# EAGLE design mega128 (EAGLE 6.4)
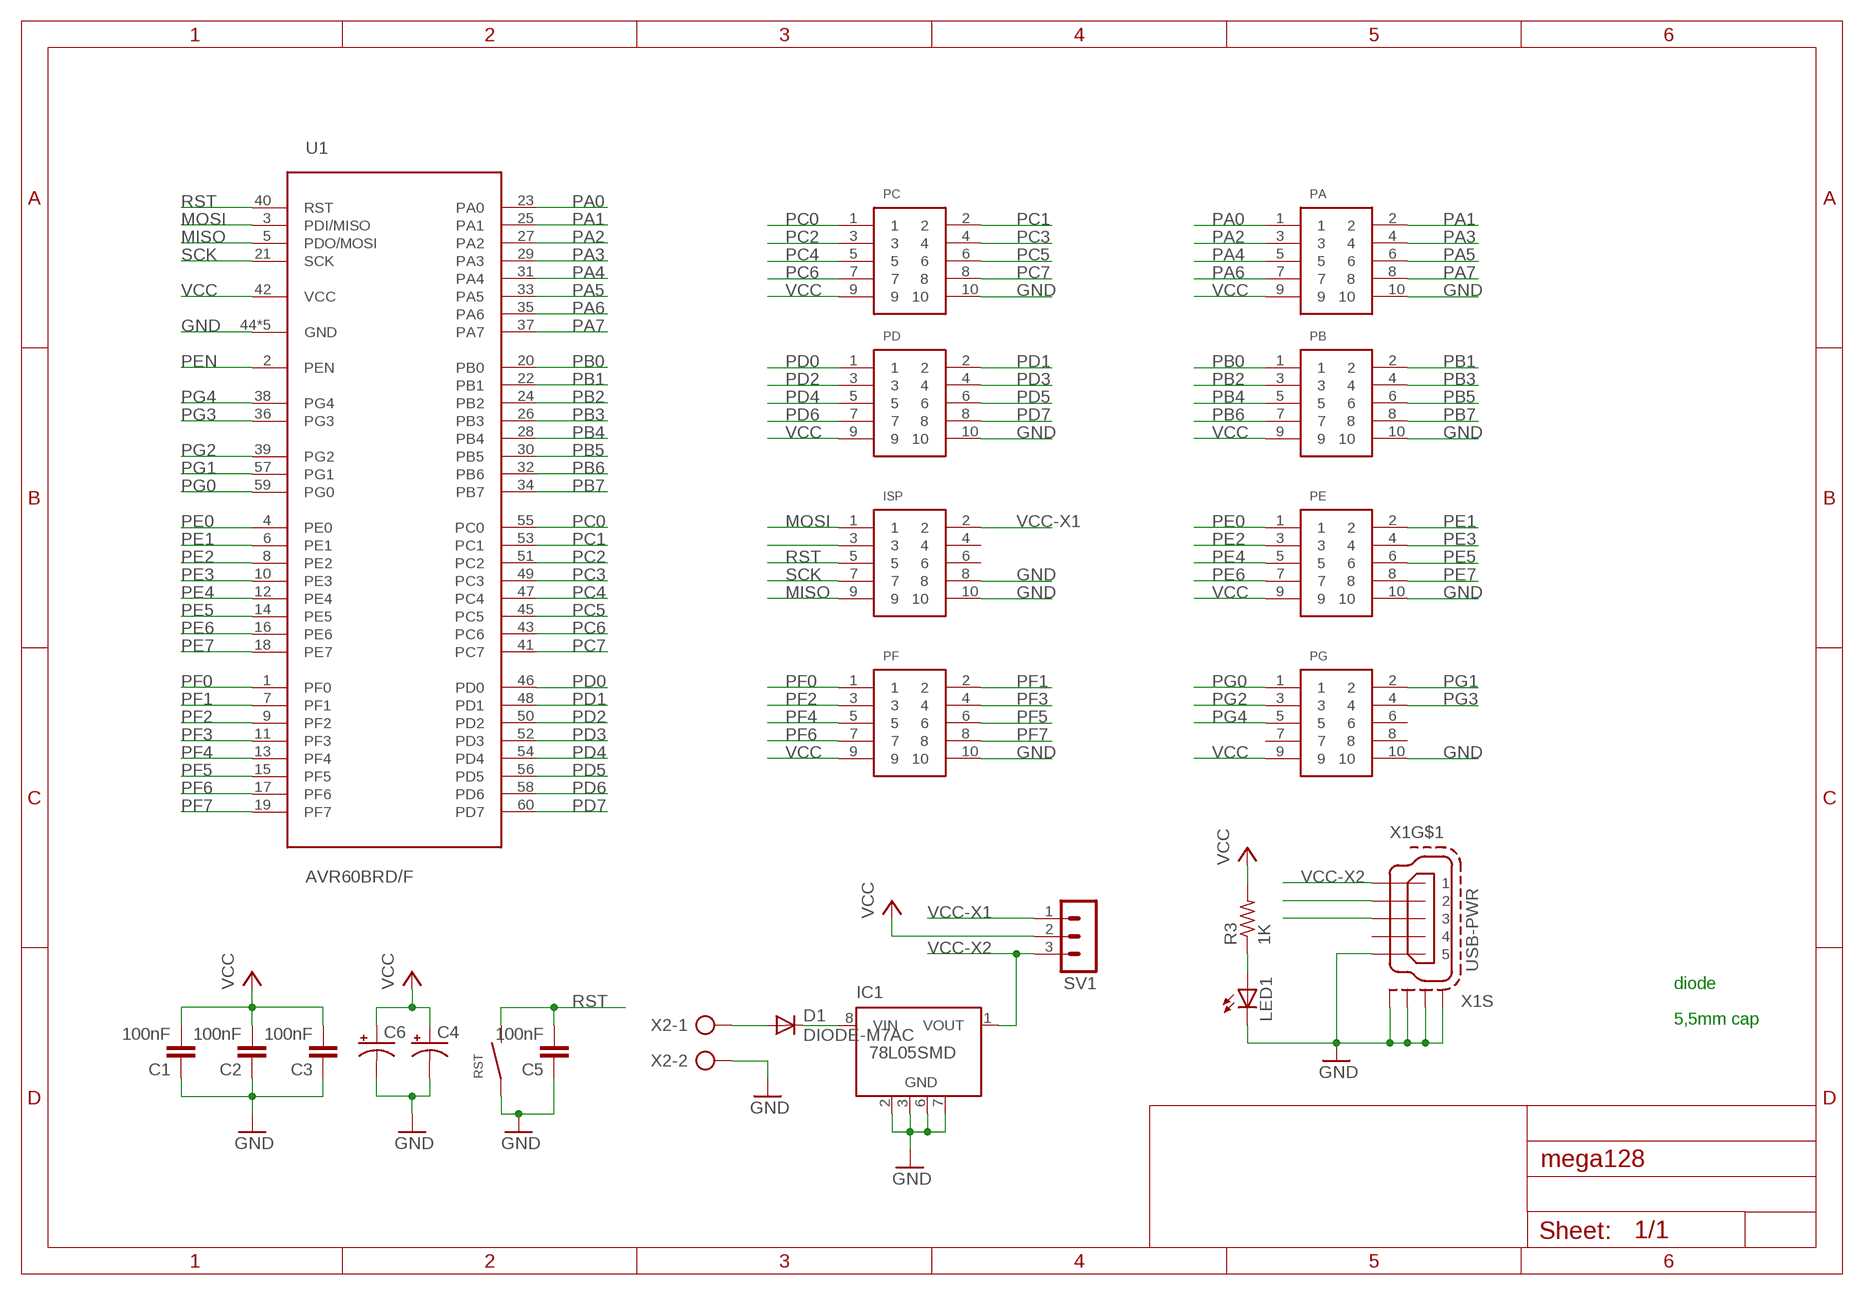
[diagram p0: schematic, sheet 1]

## Parts
C1  100nF  C-EUC0805  [C0805]
C2  100nF  C-EUC0805  [C0805]
C3  100nF  C-EUC0805  [C0805]
C4  CPOL-US085CS-1AR  [085CS_1AR]
C5  100nF  C-EUC0805  [C0805]
C6  CPOL-US085CS-1AR  [085CS_1AR]
D1  DIODE-M7AC  [M7]
IC1  78L05SMD  [SO08]
ISP  IDC-SOCK  [IDC-SOCK]
LED1  LEDSML0805  [SML0805]
PA  IDC-SOCK  [IDC-SOCK]
PB  IDC-SOCK  [IDC-SOCK]
PC  IDC-SOCK  [IDC-SOCK]
PD  IDC-SOCK  [IDC-SOCK]
PE  IDC-SOCK  [IDC-SOCK]
PF  IDC-SOCK  [IDC-SOCK]
PG  IDC-SOCK  [IDC-SOCK]
R3  1K  R-US_R0805  [R0805]
RST  SMD-BTN  [SMD-BTN]
SV1  MA03-1  [MA03-1]
U1  AVR60BRD/F  [AVR60-BRD]
X1  USB-PWR  MINI-USB-SCHIELD-32005-201  [32005-201]
X2  AK300/2  [AK300/2]

## Nets
GND: C1.1 C2.1 C3.1 C4.- C5.1 C6.- IC1.2(GND) IC1.3(GND) IC1.6(GND) IC1.7(GND) ISP.8 ISP.10 LED1.C PA.10 PB.10 PC.10 PD.10 PE.10 PF.10 PG.10 RST.1 U1.44(GND) U1.61(GND) U1.62(GND) U1.63(GND) U1.64(GND) X1.5 X1.M1(S:S1) X1.M2(S:S2) X1.M3(S:S3) X1.M4(S:S4) X2.2
MISO: ISP.9 U1.5(PDO/MOSI)
MOSI: ISP.1 U1.3(PDI/MISO)
N$1: X1.2
N$2: X1.3
N$3: LED1.A R3.1
N$7: D1.2(A) X2.1
N$9: D1.1(C) IC1.8(VIN)
N$10: ISP.3
PA0: PA.1 U1.23(PA0)
PA1: PA.2 U1.25(PA1)
PA2: PA.3 U1.27(PA2)
PA3: PA.4 U1.29(PA3)
PA4: PA.5 U1.31(PA4)
PA5: PA.6 U1.33(PA5)
PA6: PA.7 U1.35(PA6)
PA7: PA.8 U1.37(PA7)
PB0: PB.1 U1.20(PB0)
PB1: PB.2 U1.22(PB1)
PB2: PB.3 U1.24(PB2)
PB3: PB.4 U1.26(PB3)
PB4: PB.5 U1.28(PB4)
PB5: PB.6 U1.30(PB5)
PB6: PB.7 U1.32(PB6)
PB7: PB.8 U1.34(PB7)
PC0: PC.1 U1.55(PC0)
PC1: PC.2 U1.53(PC1)
PC2: PC.3 U1.51(PC2)
PC3: PC.4 U1.49(PC3)
PC4: PC.5 U1.47(PC4)
PC5: PC.6 U1.45(PC5)
PC6: PC.7 U1.43(PC6)
PC7: PC.8 U1.41(PC7)
PD0: PD.1 U1.46(PD0)
PD1: PD.2 U1.48(PD1)
PD2: PD.3 U1.50(PD2)
PD3: PD.4 U1.52(PD3)
PD4: PD.5 U1.54(PD4)
PD5: PD.6 U1.56(PD5)
PD6: PD.7 U1.58(PD6)
PD7: PD.8 U1.60(PD7)
PE0: PE.1 U1.4(PE0)
PE1: PE.2 U1.6(PE1)
PE2: PE.3 U1.8(PE2)
PE3: PE.4 U1.10(PE3)
PE4: PE.5 U1.12(PE4)
PE5: PE.6 U1.14(PE5)
PE6: PE.7 U1.16(PE6)
PE7: PE.8 U1.18(PE7)
PEN: U1.2(PEN)
PF0: PF.1 U1.1(PF0)
PF1: PF.2 U1.7(PF1)
PF2: PF.3 U1.9(PF2)
PF3: PF.4 U1.11(PF3)
PF4: PF.5 U1.13(PF4)
PF5: PF.6 U1.15(PF5)
PF6: PF.7 U1.17(PF6)
PF7: PF.8 U1.19(PF7)
PG0: PG.1 U1.59(PG0)
PG1: PG.2 U1.57(PG1)
PG2: PG.3 U1.39(PG2)
PG3: PG.4 U1.36(PG3)
PG4: PG.5 U1.38(PG4)
RST: C5.2 ISP.5 RST.2 U1.40(RST)
SCK: ISP.7 U1.21(SCK)
VCC: C1.2 C2.2 C3.2 C4.+ C6.+ PA.9 PB.9 PC.9 PD.9 PE.9 PF.9 PG.9 R3.2 SV1.2 U1.42(VCC)
VCC-X1: ISP.2 SV1.1
VCC-X2: IC1.1(VOUT) SV1.3 X1.1
Unconnected: IC1.4(NC) IC1.5(NC) ISP.4 ISP.6 PG.6 PG.7 PG.8 X1.4

## Notes on the sheet
- diode
- 5,5mm cap

## Library data of the parts
C1-C3 C5 = resistor:C-EU: CAPACITOR, European symbol
C4 C6 = rcl:CPOL-US: POLARIZED CAPACITOR, American symbol
D1 = IyunLib:DIODE-M7: DO-214AC
IC1 = linear:78L*SMD: Positive VOLTAGE REGULATOR
ISP PA PB PC PD PE PF PG = IyunLib:IDC-SOCK
LED1 = led:LED: LED OSRAM: - CHIPLED LG R971, LG N971, LY N971, LG Q971, LY Q971, LO R971, LY R971 LH N974, LH R974 LS Q976, LO Q976, LY Q976 LO Q996 - Hyper CHIPLED LW Q18S LB Q993, LB Q99A, LB R99A - SideLED LS A670, LO A670, LY A670, LG A670, LP A670 LB A673, LV A673, LT A673, LW A673 LH A674 LY A675 LS A676, LA A676, LO A676, LY A676, LW A676 LS A679, LY A679, LG A679 - Hyper Micro SIDELED® LS Y876, LA Y876, LO Y876, LY Y876 LT Y87S - SmartLED LW L88C, LW L88S LB L89C, LB L89S, LG L890 LS L89K, LO L89K, LY L89K LS L896, LA L896, LO L896, LY L896 - TOPLED LS T670, LO T670, LY T670, LG T670, LP T670 LSG T670, LSP T670, LSY T670, LOP T670, LYG T670 LG T671, LOG T671, LSG T671 LB T673, LV T673, LT T673, LW T673 LH T674 LS T676, LA T676, LO T676, LY T676, LB T676, LH T676, LSB T676, LW T676 LB T67C, LV T67C, LT T67C, LS T67K, LO T67K, LY T67K, LW E67C LS E67B, LA E67B, LO E67B, LY E67B, LB E67C, LV E67C, LT E67C LW T67C LS T679, LY T679, LG T679 LS T770, LO T770, LY T770, LG T770, LP T770 LB T773, LV T773, LT T773, LW T773 LH T774 LS E675, LA E675, LY E675, LS T675 LS T776, LA T776, LO T776, LY T776, LB T776 LHGB T686 LT T68C, LB T68C - Hyper Mini TOPLED® LB M676 - Mini TOPLED Santana® LG M470 LS M47K, LO M47K, LY M47K Source: http://www.osram.convergy.de LUXEON: - LUMILED® LXK2-PW12-R00, LXK2-PW12-S00, LXK2-PW14-U00, LXK2-PW14-V00 LXK2-PM12-R00, LXK2-PM12-S00, LXK2-PM14-U00 LXK2-PE12-Q00, LXK2-PE12-R00, LXK2-PE12-S00, LXK2-PE14-T00, LXK2-PE14-U00 LXK2-PB12-K00, LXK2-PB12-L00, LXK2-PB12-M00, LXK2-PB14-N00, LXK2-PB14-P00, LXK2-PB14-Q00 LXK2-PR12-L00, LXK2-PR12-M00, LXK2-PR14-Q00, LXK2-PR14-R00 LXK2-PD12-Q00, LXK2-PD12-R00, LXK2-PD12-S00 LXK2-PH12-R00, LXK2-PH12-S00 LXK2-PL12-P00, LXK2-PL12-Q00, LXK2-PL12-R00 Source: www.luxeon.com KINGBRIGHT: KA-3528ASYC Source: www.kingbright.com
R3 = resistor:R-US_: RESISTOR, American symbol
RST = IyunLib:SMD-BTN
SV1 = con-lstb:MA03-1: PIN HEADER; OC_FARNELL: unknown; OC_NEWARK: unknown
U1 = IyunLib:AVR60
X1 = con-cypressindustries:MINI-USB-SCHIELD-: MINI USB-B Conector Source: www.cypressindustries.com; OC_FARNELL: unknown; OC_NEWARK: unknown
X2 = con-ptr500:AK300/2: CONNECTOR; OC_FARNELL: unknown; OC_NEWARK: unknown

## Board
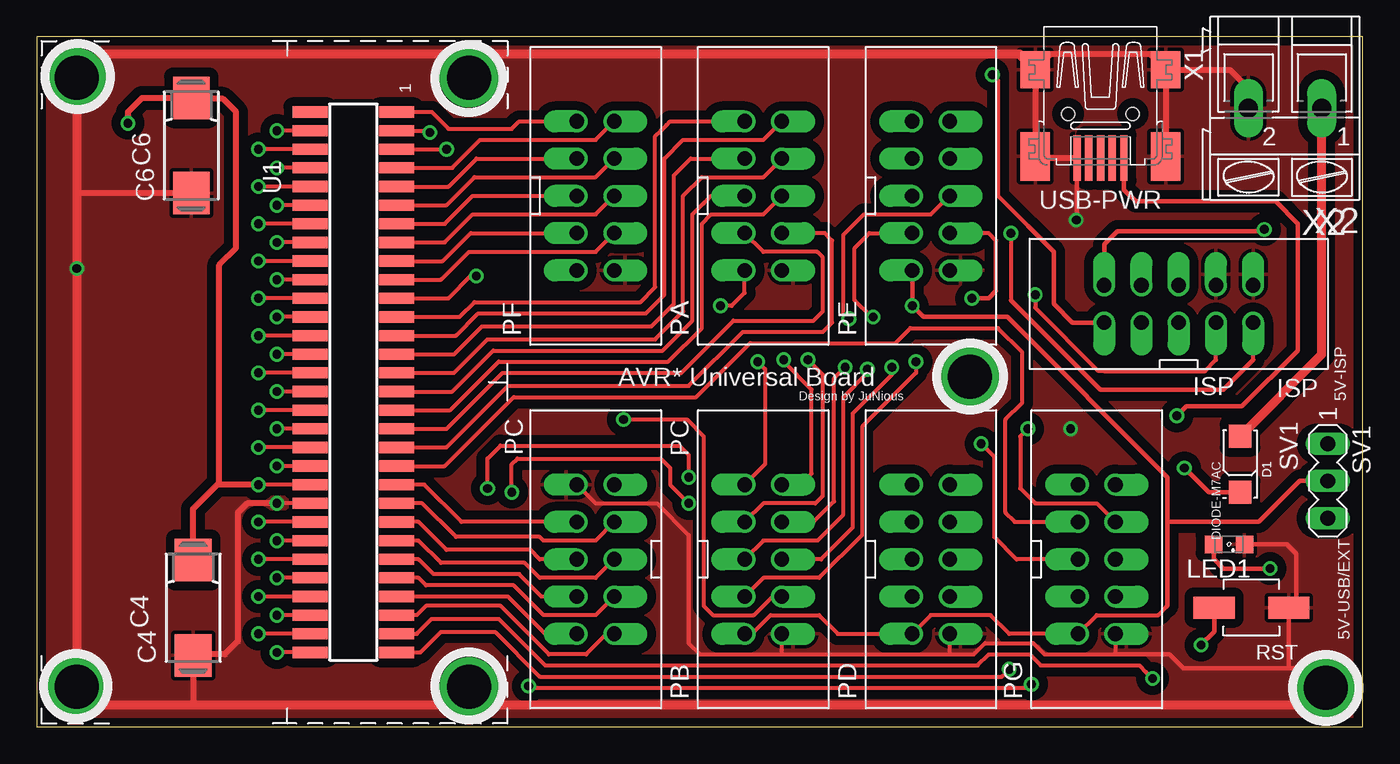
[diagram p1: board, top side]
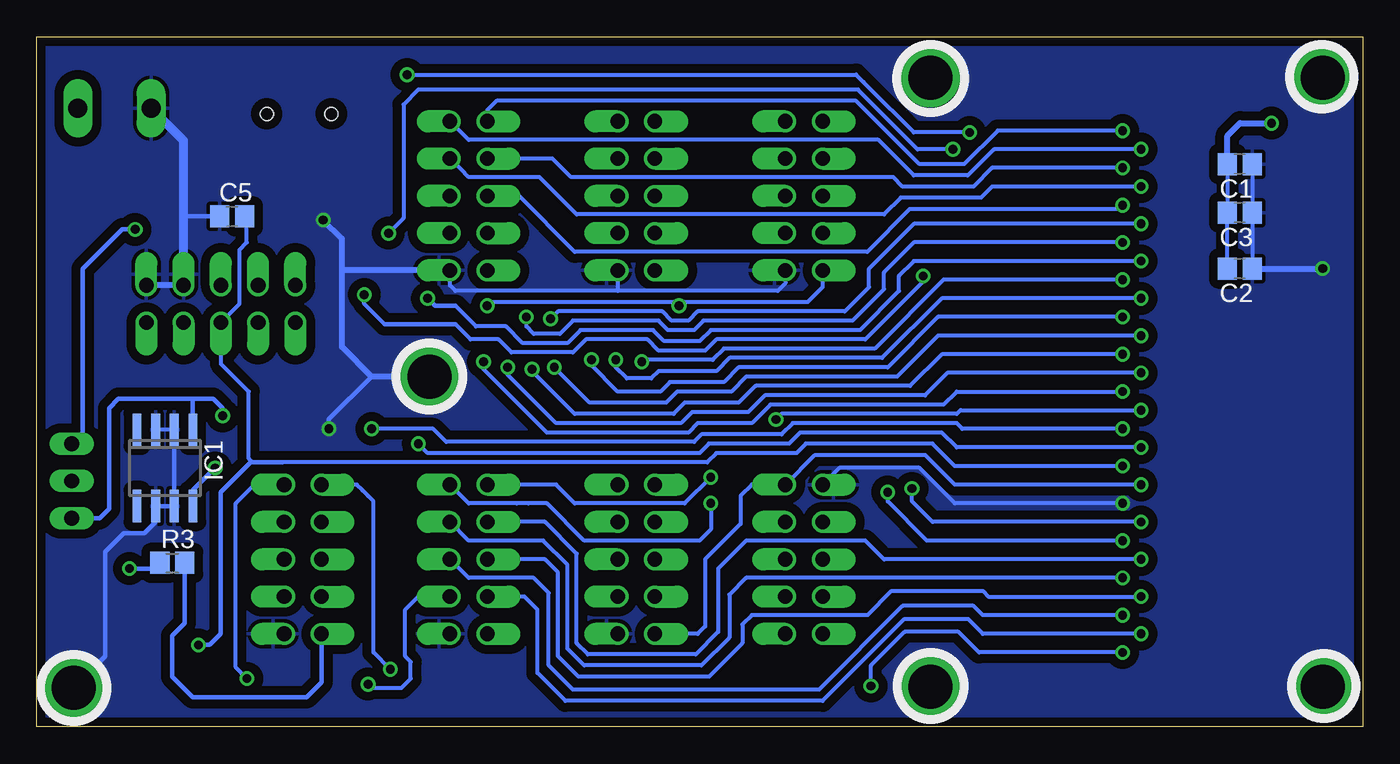
[diagram p2: board, bottom side, seen from below]

Size 90.4 x 47.04 mm. Coordinates in mm from the lower left corner, seen from the top.
Outline: 0,0 90.4,0 90.4,47.04 0,47.04 0,0
Copper layers (1*16): Top 0.035mm / dielectric 1.5mm / Bottom 0.035mm
Design rules "default *": minimum track width 10mil, minimum drill 20mil, track to track 10mil, track to pad 10mil, pad to pad 10mil, via to via 10mil, smd to smd 6mil, copper to edge 20mil, drill to drill 8mil, minimum pad ring 10mil, minimum via ring 8mil, stop-mask expansion 4mil, vias tented up to drill 0mil, thermal gap 10mil
tRestrict: area 20.3,5 to 22.9,42.2

### Footprints (pad centres in the part's own frame; a part is rotated, then mirrored left to right if it is on the bottom)
C0805 = smd 1.3 x 1.5: 1 -0.85,0; 2 0.85,0
085CS_1AR = smd 2.9 x 2.5: + 3.25,0; - -3.25,0
M7 = smd 1.57 x 1.55: 1 1.915,0; 2 -1.915,0
SO08 = smd 0.6 x 2.2: 1 -1.905,-2.6; 2 -0.635,-2.6; 3 0.635,-2.6; 4 1.905,-2.6; 5 1.905,2.6; 6 0.635,2.6; 7 -0.635,2.6; 8 -1.905,2.6
IDC-SOCK = drill 1 offset: 1 -1.27,5.08; 2 1.27,5.08; 3 -1.27,2.54; 4 1.27,2.54; 5 -1.27,0; 6 1.27,0; 7 -1.27,-2.54; 8 1.27,-2.54; 9 -1.27,-5.08; 10 1.27,-5.08
SML0805 = smd 1.2 x 1.2: A 1.05,0; C -1.05,0
R0805 = smd 1.3 x 1.5: 1 -0.85,0; 2 0.85,0
SMD-BTN = smd 2.8 x 1.5: 1 -2.54,0; 2 2.54,0
MA03-1 = drill 1.016 long: 1 -2.54,0; 2 0,0; 3 2.54,0
AVR60-BRD = smd 0.76 x 2.4: 1 18.415,-2.95; 2 18.415,2.95; 3 17.145,-2.95; 4 17.145,2.95; 5 15.875,-2.95; 6 15.875,2.95; 7 14.605,-2.95; 8 14.605,2.95; 9 13.335,-2.95; 10 13.335,2.95; 11 12.065,-2.95; 12 12.065,2.95; 13 10.795,-2.95; 14 10.795,2.95; 15 9.525,-2.95; 16 9.525,2.95; 17 8.255,-2.95; 18 8.255,2.95; 19 6.985,-2.95; 20 6.985,2.95; 21 5.715,-2.95; 22 5.715,2.95; 23 4.445,-2.95; 24 4.445,2.95; 25 3.175,-2.95; 26 3.175,2.95; 27 1.905,-2.95; 28 1.905,2.95; 29 0.635,-2.95; 30 0.635,2.95; 31 -0.635,-2.95; 32 -0.635,2.95; 33 -1.905,-2.95; 34 -1.905,2.95; 35 -3.175,-2.95; 36 -3.175,2.95; 37 -4.445,-2.95; 38 -4.445,2.95; 39 -5.715,-2.95; 40 -5.715,2.95; 41 -6.985,-2.95; 42 -6.985,2.95; 43 -8.255,-2.95; 44 -8.255,2.95; 45 -9.525,-2.95; 46 -9.525,2.95; 47 -10.795,-2.95; 48 -10.795,2.95; 49 -12.065,-2.95; 50 -12.065,2.95; 51 -13.335,-2.95; 52 -13.335,2.95; 53 -14.605,-2.95; 54 -14.605,2.95; 55 -15.875,-2.95; 56 -15.875,2.95; 57 -17.145,-2.95; 58 -17.145,2.95; 59 -18.415,-2.95; 60 -18.415,2.95 | drill 3: 61 20.75,-7.9; 62 -20.75,-7.9; 63 -20.75,18.85; 64 20.75,18.85
32005-201 = smd 3.1 x 0.5: 1 3,1.6; 2 3,0.8; 3 3,0; 4 3,-0.8; 5 3,-1.6 | smd 2.5 x 2: M1 -3,-4.45; M2 -3,4.45 | smd 3.3 x 2: M3 2.9,4.45; M4 2.9,-4.45 | hole 0.9: 0,2.2; 0,-2.2
AK300/2 = drill 1.321 long: 1 -2.515,0; 2 2.489,0

### Placement (x,y rotation side)
C1  8.38,38.35 180 bottom
C2  8.38,31.24 180 bottom
C3  8.38,35.05 180 bottom
C4  10.67,8.13 90 top
C5  77.09,34.8 0 bottom
C6  10.54,39.62 90 top
D1  82.04,17.91 270 top
IC1  81.66,17.65 180 bottom
ISP  77.85,28.83 90 top
LED1  81.28,12.45 180 top
PA  49.53,36.2 0 top
PB  49.53,11.43 0 top
PC  38.1,11.43 180 top
PD  60.96,11.43 0 top
PE  60.96,36.2 0 top
PF  38.1,36.2 0 top
PG  72.26,11.43 0 top
R3  81.15,11.18 0 bottom
RST  82.8,8.13 180 top
SV1  88.01,16.76 270 top
U1  21.59,23.5 90 top
X1  72.52,41.78 270 top
X2  85.09,42.16 180 top

### Tracks (layer width: path | path; a pad name or v marks a point on that pad's centre or on a via)
GND  (via drill 0.6, 3)
  Top 0.28: U1.44 v16.38,15.24 | PC.10 38.1,15.24 42.29,15.24 44.45,13.08 44.45,5.71 45.21,4.95 50.8,4.95 | 50.8,4.95 PB.10 | 50.8,4.95 62.23,4.95 | PG.10 73.53,5.08 73.66,4.95 | PD.10 62.23,4.95 | 70.87,38.73 X1.5 | 62.23,4.95 63.88,4.95 64.64,5.71 67.94,5.71 68.71,4.95 74.55,4.95
  Top 0.305: v87.88,2.67 86.55,4 85.34,4 | 85.34,4 RST.1 85.85,8.64 85.85,11.81 85.22,12.45 LED1.C | 73.66,4.95 74.55,4.95 77.22,4.95 78.17,4 85.34,4 | 67.64,45.21 X1.M1 | X1.5 70.92,34.59 v70.87,34.54 | 29.49,45.82 29.46,45.85
  Top 0.406: X1.5 68.17,38.78 X1.M4 X1.M1 68.07,44.83 69.09,45.85 75.9,45.85 X1.M2 | X1.M2 81.33,44.78 82.6,43.51 X2.2 | X1.M2 X1.M3 76.97,37.59 | C4.- 10.67,1.65 10.79,1.52 | v16.38,15.24 14.35,15.24 13.72,14.61 13.72,5.84 12.83,4.95 10.54,4.95 | C6.- 2.92,36.37 2.74,36.2
  Top 0.61: 67.64,45.21 67,45.85 29.46,45.85 4.34,45.85 U1.64 2.74,36.2 v2.74,31.24 U1.63 3.96,1.52 10.79,1.52 29.46,1.52 | 29.46,1.52 86.74,1.52 v87.88,2.67 | U1.62 29.49,1.55 29.46,1.52 | U1.61 29.49,45.82
  Bottom 0.28: PF.10 39.37,30.23 39.88,29.72 50.8,29.72 | 50.8,29.72 61.85,29.72 62.23,30.1 PE.10 | PA.10 50.8,29.72 | v16.38,15.24 27.81,15.24 30.23,17.65 35.69,17.65 PC.10 | C1.1 C3.1 C2.1 | 79.76,34.8 C5.1 77.72,34.8 | 70.74,34.54 v70.87,34.54 | IC1.2 IC1.3
  Bottom 0.305: 77.72,34.8 80.26,34.8 80.39,34.67 | v87.88,2.67 85.72,4.83 85.72,11.94 84.45,13.21 83.06,13.21 82.3,13.97 IC1.6 IC1.7 IC1.2 | v70.48,20.32 70.48,20.95 67.56,23.88
  Bottom 0.406: ISP.8 ISP.10 | v63.63,23.88 67.56,23.88 69.6,25.91 69.6,31.11 | 69.6,31.11 69.6,33.27 v70.87,34.54 | PE.10 69.6,31.11 | C2.1 v2.74,31.24
  Bottom 0.61: ISP.8 80.39,34.67 80.39,39.95 X2.2
  pour Bottom (isolate 0.61): 0.38,46.74 90.17,46.74 90.17,0.25 0.38,0.25
  pour Top (isolate 0.61): 0.38,46.74 90.17,46.74 90.17,0.25 0.38,0.25
MISO  (via drill 0.6)
  Top 0.28: 82.93,25.02 ISP.9 | v66.42,33.66 66.42,29.08 | U1.5 v27.94,39.37
  Top 0.305: 66.42,29.08 72.52,22.99 80.9,22.99 82.93,25.02
  Bottom 0.28: v27.94,39.37 30.35,39.37 34.42,43.43 64.39,43.43 65.41,42.42 65.41,34.67 v66.42,33.66
MOSI  (via drill 0.6)
  Top 0.28: 67.56,34.16 65.53,36.2 65.53,44.07 v65.15,44.45 | U1.3 26.67,40.64 v26.8,40.51
  Top 0.305: 67.56,34.16 69.34,32.38 69.34,28.83 70.61,27.56 ISP.1
  Bottom 0.28: v26.8,40.51 30.61,40.51 33.66,43.56 34.04,43.94 34.54,44.45 v65.15,44.45
N$3  (via drill 0.6)
  Top 0.305: LED1.A 80.23,11.46 80.9,10.79 v84.07,10.79
  Bottom 0.305: R3.1 82.38,10.79 v84.07,10.79
N$7
  Top 0.61: D1.2 87.61,25.39 X2.1
N$9  (via drill 0.6)
  Top 0.305: D1.1 79.89,15.99 v78.23,17.65
  Bottom 0.305: v78.23,17.65 79.76,16.13 IC1.8
PA0
  Top 0.28: U1.23 28.83,27.94 29.84,28.96 41.15,28.96 42.16,29.97 42.16,40.26 42.55,40.64 42.93,41.02 43.18,41.27 PA.1
PA1
  Top 0.28: U1.25 28.57,26.67 30.1,28.19 41.53,28.19 42.8,29.46 42.8,38.73 44.07,40.01 49.53,40.01 PA.2
PA2
  Top 0.28: U1.27 28.45,25.4 30.35,27.3 41.91,27.3 43.43,28.83 43.43,37.59 43.94,38.1 44.13,38.29 44.58,38.73 PA.3
PA3
  Top 0.28: U1.29 28.45,24.13 30.73,26.42 42.16,26.42 44.07,28.32 44.07,36.2 45.34,37.47 49.53,37.47 PA.4
PA4
  Top 0.28: U1.31 28.32,22.86 31.11,25.65 42.67,25.65 44.7,27.69 44.7,34.92 45.47,35.69 45.72,35.94 45.97,36.2 PA.5
PA5
  Top 0.28: U1.33 28.19,21.59 31.5,24.89 43.05,24.89 45.34,27.18 45.34,34.29 45.97,34.92 49.53,34.92 PA.6
PA6
  Top 0.28: U1.35 27.94,20.32 31.75,24.13 43.94,24.13 47.5,27.69 52.96,27.69 53.59,28.32 53.59,32 53.21,32.38 49.53,32.38 PA.7
PA7
  Top 0.28: U1.37 27.94,19.05 32.13,23.24 44.45,23.24 48.13,26.92 53.59,26.92 54.23,27.56 54.23,33.15 53.72,33.66 PA.8
PB0  (via drill 0.6)
  Top 0.28: U1.20 v16.38,30.48 | PB.1 49.66,17.91 49.66,24.38 v49.15,24.89
  Bottom 0.28: v16.38,30.48 28.57,30.48 33.27,25.78 43.56,25.78 44.32,25.02 49.02,25.02 v49.15,24.89
PB1  (via drill 0.6)
  Top 0.28: U1.22 v15.11,29.21 | PB.2 52.07,16.51 52.83,17.27 52.83,22.99 50.93,24.89 v50.93,25.02
  Bottom 0.28: v15.11,29.21 28.7,29.21 32.77,25.15 43.18,25.15 44.07,24.26 48.01,24.26 48.51,23.75 50.16,23.75 50.93,24.51 v50.93,25.02
PB2  (via drill 0.6)
  Top 0.28: U1.24 v16.38,27.94 | PB.3 49.53,15.24 53.09,15.24 53.59,15.75 53.59,24 v52.58,25.02
  Bottom 0.28: v16.38,27.94 28.96,27.94 32.38,24.51 42.55,24.51 43.56,23.5 47.24,23.5 47.88,22.86 50.8,22.86 52.58,24.64 v52.58,25.02
PB3  (via drill 0.6)
  Top 0.28: U1.26 v15.11,26.67 | PB.4 52.96,13.97 54.36,15.37 54.36,23.75 v55.12,24.51
  Bottom 0.28: v15.11,26.67 28.96,26.67 31.75,23.88 42.04,23.88 43.05,22.86 46.74,22.86 47.5,22.1 52.7,22.1 v55.12,24.51
PB4  (via drill 0.6)
  Top 0.28: U1.28 v16.38,25.4 | v56.64,24.38 56.64,24.13 54.99,22.48 54.99,14.48 53.21,12.7 49.53,12.7 PB.5
  Bottom 0.28: v16.38,25.4 28.7,25.4 30.86,23.24 41.4,23.24 42.55,22.1 46.23,22.1 46.99,21.34 53.72,21.34 55.75,23.37 55.82,23.43 56.64,24.26 v56.64,24.38
PB5  (via drill 0.6)
  Top 0.28: U1.30 v15.11,24.13 | v58.29,24.51 58.29,24 55.63,21.34 55.63,13.59 53.47,11.43 PB.6
  Bottom 0.28: v15.11,24.13 28.32,24.13 29.84,22.61 40.77,22.61 41.91,21.46 45.72,21.46 46.48,20.7 54.99,20.7 56.9,22.61 57.4,23.11 58.29,24 v58.29,24.51
PB6  (via drill 0.6)
  Top 0.28: U1.32 v16.38,22.86 | v59.94,24.89 59.94,24.13 56.26,20.45 56.26,13.08 53.34,10.16 49.53,10.16 PB.7
  Bottom 0.28: v59.94,24.89 59.94,24.38 57.53,21.97 57.4,21.84 55.63,20.07 45.97,20.07 45.34,20.7 41.66,20.7 40.39,21.97 28.57,21.97 27.69,22.86 v16.38,22.86
PB7  (via drill 0.6)
  Top 0.28: U1.34 v15.11,21.59 | v40.01,20.95 44.32,20.95 45.47,19.81 45.47,8.26 46.1,7.62 48.9,7.62 50.16,8.89 PB.8
  Bottom 0.28: v40.01,20.95 39.62,21.34 27.69,21.34 27.43,21.59 v15.11,21.59
PC0
  Top 0.28: PC.1 38.86,6.35 37.47,4.95 34.92,4.95 31.62,8.26 26.54,8.26 25.91,7.62 U1.55
PC1
  Top 0.28: PC.2 34.67,6.35 32.13,8.89 U1.53
PC2
  Top 0.28: PC.3 38.1,7.62 34.54,7.62 32.51,9.65 26.54,9.65 26.04,10.16 U1.51
PC3
  Top 0.28: PC.4 34.42,8.89 32.89,10.41 27.05,10.41 26.04,11.43 U1.49
PC4
  Top 0.28: PC.5 38.1,10.16 34.29,10.16 33.27,11.18 27.56,11.18 26.04,12.7 U1.47
PC5
  Top 0.28: PC.6 34.29,11.43 33.66,12.06 27.94,12.06 26.04,13.97 U1.45
PC6
  Top 0.28: PC.7 38.1,12.7 34.54,12.7 34.29,12.95 28.57,12.95 26.29,15.24 U1.43
PC7
  Top 0.28: PC.8 28.96,13.97 26.42,16.51 U1.41
PD0  (via drill 0.6)
  Top 0.28: U1.46 v15.11,13.97 | v30.73,16.26 30.73,18.29 31.62,19.18 43.81,19.18 44.45,18.54 v44.45,17.02
  Bottom 0.28: v15.11,13.97 29.34,13.97 30.73,15.37 v30.73,16.26 | v44.45,17.02 46.23,15.24 53.72,15.24 54.99,16.51 PD.1
PD1  (via drill 0.6)
  Top 0.28: U1.48 v16.38,12.7 | v32.38,16 32.38,17.91 32.77,18.29 42.55,18.29 43.18,17.65 43.18,16.51 v44.45,15.24
  Bottom 0.28: v16.38,12.7 29.72,12.7 32.38,15.37 v32.38,16 | PD.2 60.96,15.24 57.66,15.24 56.9,15.24 55.63,15.24 53.09,12.7 45.21,12.7 44.45,13.46 v44.45,15.24
PD2  (via drill 0.6)
  Top 0.28: U1.50 v15.11,11.43
  Bottom 0.28: v15.11,11.43 32.64,11.43 33.91,12.7 42.04,12.7 43.94,10.79 43.94,6.48 45.47,4.95 52.83,4.95 53.59,5.71 53.59,11.81 55.75,13.97 PD.3
PD3  (via drill 0.6)
  Top 0.28: U1.52 v16.38,10.16
  Bottom 0.28: v16.38,10.16 42.04,10.16 43.18,9.02 43.18,6.1 45.09,4.19 53.09,4.19 54.23,5.33 54.23,11.05 55.88,12.7 60.96,12.7 PD.4
PD4  (via drill 0.6)
  Top 0.28: U1.54 v15.11,8.89
  Bottom 0.28: v15.11,8.89 25.53,8.89 25.91,9.27 32.13,9.27 33.78,7.62 41.66,7.62 42.29,6.99 42.29,5.71 44.58,3.43 53.47,3.43 54.86,4.83 54.86,10.54 55.75,11.43 PD.5
PD5  (via drill 0.6)
  Top 0.28: U1.56 v16.38,7.62
  Bottom 0.28: v16.38,7.62 25.91,7.62 26.54,8.26 31.37,8.26 37.08,2.54 53.85,2.54 55.5,4.19 55.5,9.14 56.52,10.16 60.96,10.16 PD.6
PD6  (via drill 0.6)
  Top 0.28: U1.58 v15.11,6.35
  Bottom 0.28: v15.11,6.35 25.91,6.35 26.92,7.37 31.24,7.37 36.83,1.78 54.36,1.78 56.26,3.68 56.26,8 57.15,8.89 PD.7
PD7  (via drill 0.6)
  Top 0.28: U1.60 v16.38,5.08 | v33.53,2.79 33.66,2.67 67.56,2.67 v67.82,2.92
  Bottom 0.28: v16.38,5.08 26.16,5.08 27.56,6.48 31.24,6.48 33.53,4.19 v33.53,2.79 | PD.8 64.39,8.89 65.28,8 65.28,4.83 64.9,4.45 64.9,3.3 65.53,2.67 67.56,2.67 v67.82,2.92
PE0  (via drill 0.6)
  Top 0.28: U1.4 v16.38,40.64
  Bottom 0.28: v16.38,40.64 24.89,40.64 27.18,38.35 30.23,38.35 34.54,42.67 59.05,42.67 59.69,42.04 PE.1
PE1  (via drill 0.6)
  Top 0.28: U1.6 v15.11,39.37
  Bottom 0.28: v15.11,39.37 25.15,39.37 26.92,37.59 30.61,37.59 33.02,40.01 60.96,40.01 PE.2
PE2  (via drill 0.6)
  Top 0.28: U1.8 v16.38,38.1
  Bottom 0.28: v16.38,38.1 25.27,38.1 26.54,36.83 31.37,36.83 32,37.47 53.98,37.47 55.24,38.73 PE.3
PE3  (via drill 0.6)
  Top 0.28: U1.10 v15.11,36.83
  Bottom 0.28: v15.11,36.83 25.27,36.83 26.04,36.07 31.5,36.07 32.64,34.92 53.59,34.92 56.13,37.47 60.96,37.47 61.09,37.59 61.21,37.72 PE.4
PE4  (via drill 0.6)
  Top 0.28: U1.12 v16.38,35.56
  Bottom 0.28: PE.5 57.53,36.2 53.72,32.38 33.78,32.38 30.86,35.31 16.64,35.31 v16.38,35.56
PE5  (via drill 0.6)
  Top 0.28: U1.14 v15.11,34.29 | PE.6 60.96,34.92 56.39,34.92 54.99,33.53 54.99,28.19 v55.37,27.81
  Bottom 0.28: v15.11,34.29 30.61,34.29 33.66,31.24 33.66,29.97 35.31,28.32 45.34,28.32 45.97,27.69 47.12,27.69 47.75,28.32 54.86,28.32 v55.37,27.81
PE6  (via drill 0.6)
  Top 0.28: U1.16 v16.38,33.02 | v57.02,27.94 56.9,27.94 55.75,29.08 55.75,32.64 56.77,33.66 PE.7
  Bottom 0.28: v16.38,33.02 30.61,33.02 32.64,30.99 32.64,29.84 34.8,27.69 44.96,27.69 45.59,27.05 47.37,27.05 48.01,27.69 53.85,27.69 54.74,26.8 56.52,26.8 57.02,27.3 v57.02,27.94
PE7  (via drill 0.6)
  Top 0.28: U1.18 v15.11,31.75 | 65.41,29.72 65.41,33.15 64.9,33.66 PE.8
  Top 0.305: v63.75,29.21 64.9,29.21 65.41,29.72
  Bottom 0.28: v15.11,31.75 30.61,31.75 31.62,30.73 31.62,29.72 34.29,27.05 44.45,27.05 45.21,26.29 47.62,26.29 48.39,27.05 53.34,27.05 54.23,26.16 57.28,26.16 58.42,27.3 60.45,27.3 61.85,28.7
  Bottom 0.305: 61.85,28.7 63.25,28.7 v63.75,29.21
PF0
  Top 0.28: U1.1 26.92,41.91 28.07,40.77 32.38,40.77 32.89,41.27 PF.1
PF1
  Top 0.28: U1.7 28.32,38.1 30.23,40.01 38.1,40.01 PF.2
PF2
  Top 0.28: U1.9 28.07,36.83 29.97,38.73 PF.3
PF3
  Top 0.28: U1.11 27.94,35.56 29.84,37.47 38.1,37.47 PF.4
PF4
  Top 0.28: U1.13 27.81,34.29 29.72,36.2 PF.5
PF5
  Top 0.28: U1.15 27.81,33.02 29.72,34.92 38.1,34.92 PF.6
PF6
  Top 0.28: U1.17 27.69,31.75 29.59,33.66 PF.7
PF7
  Top 0.28: U1.19 27.56,30.48 29.46,32.38 38.1,32.38 PF.8
PG0  (via drill 0.6)
  Top 0.28: U1.59 26.16,5.08 27.56,6.48 31.24,6.48 34.29,3.43 65.79,3.43 v66.29,3.94
  Bottom 0.28: PG.1 68.58,16.51 68.2,16.13 67.82,15.75 67.44,15.37 67.44,5.08 v66.29,3.94
PG1  (via drill 0.6)
  Top 0.28: U1.57 25.91,6.35 26.92,7.37 31.5,7.37 34.67,4.19 64.14,4.19 64.9,4.95 67.69,4.95 68.45,4.19 75.18,4.19 75.63,3.75 v76.07,3.3
  Bottom 0.28: v76.07,3.3 76.83,4.06 76.83,15.24 75.56,16.51 PG.2
PG2
  Top 0.28: U1.39 27.81,17.78 32.51,22.48 44.96,22.48 48.64,26.16 58.55,26.16 59.56,27.18 65.53,27.18 67.18,25.53 67.18,22.1 66.04,20.95 66.04,14.61 66.67,13.97 PG.3
PG3  (via drill 0.6)
  Top 0.28: U1.36 v16.38,20.32 | v67.56,20.32 67.06,19.81 67.06,16.26 68.07,15.24 72.26,15.24 PG.4
  Bottom 0.28: v16.38,20.32 27.3,20.32 27.69,20.7 38.86,20.7 39.62,19.94 45.09,19.94 45.59,19.43 62.48,19.43 63.37,20.32 v67.56,20.32
PG4  (via drill 0.6)
  Top 0.28: U1.38 v15.11,19.05 | PG.5 66.8,11.43 65.28,12.95 65.28,18.41 v64.39,19.3
  Bottom 0.28: v15.11,19.05 27.69,19.05 28.7,20.07 38.35,20.07 39.12,19.3 44.58,19.3 45.21,18.67 63.75,18.67 v64.39,19.3
RST  (via drill 0.6)
  Top 0.28: U1.40 v16.38,17.78
  Top 0.305: RST.2 80.26,6.48 v79.38,5.59
  Bottom 0.28: v16.38,17.78 27.81,17.78 29.34,19.3 37.97,19.3 38.61,18.67 44.07,18.67 44.7,18.03 73.66,18.03 | C5.2 76.07,34.63 76.07,33.02 76.58,32.51 76.58,28.83 ISP.5 77.85,24.77 75.95,22.86 75.95,18.29 75.69,18.03
  Bottom 0.305: 73.66,18.03 75.69,18.03 75.82,18.03 77.85,16 77.85,6.35 78.61,5.59 v79.38,5.59
SCK  (via drill 0.6)
  Top 0.28: U1.21 28.07,29.21 29.59,30.73 v29.97,30.73 | 79.63,24.26 80.39,25.02 ISP.7 | 68.07,29.34 68.07,28.57 72.39,24.26 72.77,24.26
  Top 0.305: 72.77,24.26 79.63,24.26 | v68.07,29.46 68.07,29.34
  Bottom 0.28: v29.97,30.73 29.97,30.35 33.91,26.42 44.07,26.42 44.83,25.65 48.01,25.65 48.77,26.42 52.96,26.42 53.85,25.53 58.04,25.53 58.93,26.42 60.83,26.42 61.85,27.43 | 66.67,27.43 68.07,28.83 v68.07,29.46
  Bottom 0.305: 61.85,27.43 66.67,27.43
VCC  (via drill 0.6)
  Top 0.28: PA.9 48.26,29.59 47.37,28.7 v46.61,28.7 | U1.42 v15.11,16.51 | PB.9 48.77,6.35 50.04,7.62 53.34,7.62 54.61,6.35 PD.9 60.96,7.62 65.02,7.62 66.29,6.35 PG.9 72.26,7.62 76.45,7.62 77.03,8.19
  Top 0.305: 77.09,13.97 77.09,17.02 66.17,27.94 60.45,27.94 v59.69,28.7 PE.9 | 77.09,13.97 77.09,8.26 77.03,8.19 | 77.09,13.97 83.31,13.97 86.11,16.76 SV1.2
  Top 0.406: C4.+ 10.67,14.86 12.32,16.51 | v15.11,16.51 12.32,16.51 | v6.22,41.15 6.22,41.91 7.19,42.87 C6.+ 10.62,42.8 12.7,42.8 13.59,41.91 13.59,32.64 12.45,31.5 12.45,16.64 12.32,16.51
  Bottom 0.28: PF.9 36.83,29.97 37.85,28.96 46.61,28.96 | v46.61,28.7 46.61,28.96 | 46.61,28.96 59.44,28.96 v59.69,28.7 | v15.11,16.51 27.81,16.51 29.84,18.54 37.34,18.54 PC.9 41.66,16.51 42.42,15.75 42.42,13.84 44.83,11.43 44.83,6.86 45.34,6.35 PB.9 | C1.2 C3.2 C2.2
  Bottom 0.305: R3.2 80.3,7.07 81.15,6.22 81.15,3.43 79.76,2.03 72.01,2.03 70.99,3.05 PG.9
  Bottom 0.406: C1.2 9.23,40.3 8.38,41.15 v6.22,41.15
VCC-X1  (via drill 0.6)
  Top 0.305: ISP.2 72.77,32.89 73.66,33.78 83.57,33.78 v83.69,33.91
  Bottom 0.305: v83.69,33.91 84.58,33.91 87.25,31.24 87.25,20.07 SV1.1
VCC-X2  (via drill 0.6)
  Top 0.305: X1.1 74.12,36.63 74.93,35.81 84.45,35.81 85.98,34.29 85.98,25.65 82.17,21.84 78.36,21.84 v77.72,21.21
  Bottom 0.305: SV1.3 86.11,14.22 85.47,14.86 85.47,21.72 84.84,22.35 79.76,22.35 | IC1.1 79.76,22.35 | v77.72,21.21 77.72,21.72 78.36,22.35 79.76,22.35

### Text on the board
_tNames: X1 | C6 | U1 | USB-PWR | X2 | PF | PA | PE | ISP | AVR* Universal Board | Design by JuNious | 5V-ISP | SV1 | PC | D1 | LED1 | C4 | RST | 5V-USB/EXT | PB | PD | PG
_bNames: C1 | C5 | C3 | C2 | IC1 | R3